# EAGLE design hackgt6-badge-prototype (EAGLE 9.4.2)
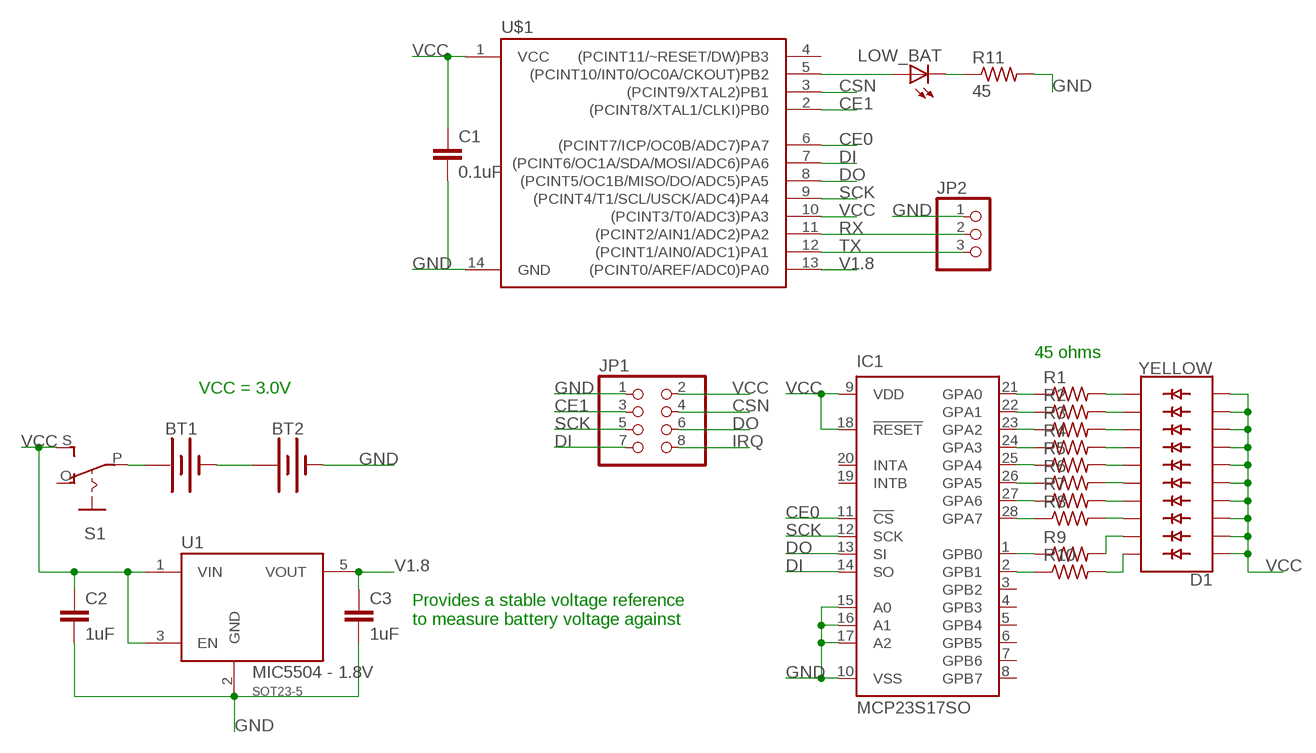
[diagram p0: schematic, sheet 1]

## Parts
BT1  BATTERY-AA-SMD  [BATTERY-AA-SMD]
BT2  BATTERY-AA-SMD  [BATTERY-AA-SMD]
C1  0.1uF  C-EUC1206  [C1206]
C2  1uF  C-EUC1206  [C1206]
C3  1uF  C-EUC1206  [C1206]
D1  YELLOW  LED_BARGRAPH_10YELLOW  [LED_BARGRAPH_10]
IC1  MCP23S17SO  [SO28W]
JP1  PINHD-2X4/90  [2X04/90]
JP2  PINHD-1X3  [1X03]
LOW_BAT  LEDCHIPLED_1206  [CHIPLED_1206]
R1  R-US_R1206  [R1206]
R2  R-US_R1206  [R1206]
R3  R-US_R1206  [R1206]
R4  R-US_R1206  [R1206]
R5  R-US_R1206  [R1206]
R6  R-US_R1206  [R1206]
R7  R-US_R1206  [R1206]
R8  R-US_R1206  [R1206]
R9  R-US_R1206  [R1206]
R10  R-US_R1206  [R1206]
R11  45  R-US_R1206  [R1206]
S1  EG1218S  [EG1218]
U1  MIC5504 - 1.8V  MIC550X-YM5  [SOT23-5-DBV]
U$1  ATTINY84ATTINY84-20PU  [DIP14]

## Nets
CE0: IC1.11(!CS) U$1.6((PCINT7/ICP/OC0B/ADC7)PA7)
CE1: JP1.3 U$1.2((PCINT8/XTAL1/CLKI)PB0)
CSN: JP1.4 U$1.3((PCINT9/XTAL2)PB1)
DI: IC1.14(SO) JP1.7 U$1.7((PCINT6/OC1A/SDA/MOSI/ADC6)PA6)
DO: IC1.13(SI) JP1.6 U$1.8((PCINT5/OC1B/MISO/DO/ADC5)PA5)
GND: BT2.P$2(-) BT2.P$4(-) C1.2 C2.2 C3.2 IC1.10(VSS) IC1.15(A0) IC1.16(A1) IC1.17(A2) JP1.1 JP2.1 R11.2 U1.2(GND) U$1.14(GND)
IRQ: JP1.8
N$1: BT1.P$2(-) BT1.P$4(-) BT2.P$1(+) BT2.P$3(+)
N$2: BT1.P$1(+) BT1.P$3(+) S1.P
N$3: IC1.21(GPA0) R1.1
N$4: LOW_BAT.A U$1.5((PCINT10/INT0/OC0A/CKOUT)PB2)
N$5: IC1.22(GPA1) R2.1
N$6: D1.11(C9) R1.2
N$7: D1.12(C8) R2.2
N$8: D1.13(C7) R3.2
N$9: D1.14(C6) R4.2
N$10: D1.15(C5) R5.2
N$11: D1.16(C4) R6.2
N$12: D1.17(C3) R7.2
N$13: D1.18(C2) R8.2
N$14: D1.19(C1) R9.2
N$15: D1.20(C) R10.2
N$16: IC1.1(GPB0) R9.1
N$17: IC1.2(GPB1) R10.1
N$18: IC1.28(GPA7) R8.1
N$19: IC1.27(GPA6) R7.1
N$20: IC1.26(GPA5) R6.1
N$21: IC1.25(GPA4) R5.1
N$22: IC1.24(GPA3) R4.1
N$23: IC1.23(GPA2) R3.1
N$24: LOW_BAT.C R11.1
RX: JP2.2 U$1.11((PCINT2/AIN1/ADC2)PA2)
SCK: IC1.12(SCK) JP1.5 U$1.9((PCINT4/T1/SCL/USCK/ADC4)PA4)
TX: JP2.3 U$1.12((PCINT1/AIN0/ADC1)PA1)
V1.8: C3.1 U1.5(VOUT) U$1.13((PCINT0/AREF/ADC0)PA0)
VCC: C1.1 C2.1 D1.1(A) D1.2(A1) D1.3(A2) D1.4(A3) D1.5(A4) D1.6(A5) D1.7(A6) D1.8(A7) D1.9(A8) D1.10(A9) IC1.9(VDD) IC1.18(!RESET) JP1.2 S1.S U1.1(VIN) U1.3(EN) U$1.1(VCC) U$1.10((PCINT3/T0/ADC3)PA3)
Unconnected: IC1.3(GPB2) IC1.4(GPB3) IC1.5(GPB4) IC1.6(GPB5) IC1.7(GPB6) IC1.8(GPB7) IC1.19(INTB) IC1.20(INTA) S1.O U$1.4((PCINT11/~RESET/DW)PB3)

## Notes on the sheet
- 45 ohms
- VCC = 3.0V
- Provides a stable voltage reference
  to measure battery voltage against

## Library data of the parts
BT1 BT2 = Batteries:BATTERY: Battery - Single Cell A variety of battery chemistries, sizes, and footprints. Device List: 20MM_PTH - Coin Cell Battery Holder - 20mm (PTH) <https://www.sparkfun.com/products/783> 6.8MM_PTH - Coin Cell Battery Holder - 6.8MM(SMD) <https://www.digikey.com/product-detail/en/seiko-instruments/MS621FE-FL11E/728-1057-ND/1889208?WT.srch=1&gclid=CNOQ5a6LzdQCFZS2wAodXCkE0g> 12MM_SMD - Coin Cell Battery Holder - 12mm (SMD) <https://www.sparkfun.com/products/10592> 12MM_PTH - Coin Cell Battery Holder - 12mm (PTH) <https://www.sparkfun.com/products/7948> 20MM_SMD - 20mm Coin Cell Battery Holder (SMD) (2 legs) Used on the Big Time Watch Kit <https://www.sparkfun.com/products/11734> 20MM_SMD_4LEGS - Coin Cell Battery Holder - 20mm (SMD) <https://www.sparkfun.com/products/11892> 20MM_SMD_4LEGS_OVERPASTE - Coin Cell Battery Holder - 20mm (SMD) <https://www.sparkfun.com/products/11892> (Over-paste on the legs) 24.5MM_PTH - Coin Cell Battery Holder - 24.5mm (PTH) <https://www.sparkfun.com/products/8863> 9V - 9V Battery Holder - PC Mount Used on the SparkFun SparkPunk Sound Kit <https://www.sparkfun.com/products/11177> and SparkFun SparkPunk Sequencer Kit <https://www.sparkfun.com/products/12707> 18650 - Battery Holder - 18650 (PTH) <https://www.sparkfun.com/products/13113> AA - Battery Holder - 1xAA (PTH) <https://www.sparkfun.com/products/7949> AAA - Battery Holder - 1xAAA (PTH) <https://www.sparkfun.com/products/12718> AA_KIT - Battery Holder - 1xAA (PTH) <https://www.sparkfun.com/products/7949> Special kit package - pads only have exposed copper on one side of the board. AAA_KIT - Battery Holder - 1xAAA (PTH) <https://www.sparkfun.com/products/12718> Special kit package - pads only have exposed copper on one side of the board.
C1-C3 = rcl:C-EU: CAPACITOR, European symbol; SPICEPREFIX: C
D1 = SparkFun-LED:LED_BARGRAPH_10: Young Sun LED Tech - YSLB-10251G5-10 10-Segment LED Bar Graph Features: Red Vf = 2.1V, Ifmax = 20mA Yellow Vf = 2.1V, Ifmax = 20mA Blue Vf = 3.4V, Ifmax = 20mA Green Vf = 3.4V, Ifmax = 20mA SparkFun Products: Red <https://www.sparkfun.com/products/9935> Yellow <https://www.sparkfun.com/products/9936> Green <https://www.sparkfun.com/products/9938> Blue <https://www.sparkfun.com/products/9937>; PROD_ID: DIO-10614
IC1 = microchip:MCP23S17: http://ww1.microchip.com/downloads/en/DeviceDoc/21952a.pdf Source: http://ww1.microchip.com/downloads/en/DeviceDoc/21952a.pdf; MF: MICROCHIP; MPN: MCP23S17-E/SO; OC_FARNELL: unknown; OC_NEWARK: 31K2950
JP1 = pinhead:PINHD-2X4: PIN HEADER
JP2 = adafruit:PINHD-1X3: PIN HEADER
LOW_BAT = adafruit:LED: LED OSRAM: - CHIPLED LG R971, LG N971, LY N971, LG Q971, LY Q971, LO R971, LY R971 LH N974, LH R974 LS Q976, LO Q976, LY Q976 LO Q996 - Hyper CHIPLED LW Q18S LB Q993, LB Q99A, LB R99A - SideLED LS A670, LO A670, LY A670, LG A670, LP A670 LB A673, LV A673, LT A673, LW A673 LH A674 LY A675 LS A676, LA A676, LO A676, LY A676, LW A676 LS A679, LY A679, LG A679 - Hyper Micro SIDELED® LS Y876, LA Y876, LO Y876, LY Y876 LT Y87S - SmartLED LW L88C, LW L88S LB L89C, LB L89S, LG L890 LS L89K, LO L89K, LY L89K LS L896, LA L896, LO L896, LY L896 - TOPLED LS T670, LO T670, LY T670, LG T670, LP T670 LSG T670, LSP T670, LSY T670, LOP T670, LYG T670 LG T671, LOG T671, LSG T671 LB T673, LV T673, LT T673, LW T673 LH T674 LS T676, LA T676, LO T676, LY T676, LB T676, LH T676, LSB T676, LW T676 LB T67C, LV T67C, LT T67C, LS T67K, LO T67K, LY T67K, LW E67C LS E67B, LA E67B, LO E67B, LY E67B, LB E67C, LV E67C, LT E67C LW T67C LS T679, LY T679, LG T679 LS T770, LO T770, LY T770, LG T770, LP T770 LB T773, LV T773, LT T773, LW T773 LH T774 LS E675, LA E675, LY E675, LS T675 LS T776, LA T776, LO T776, LY T776, LB T776 LHGB T686 LT T68C, LB T68C - Hyper Mini TOPLED® LB M676 - Mini TOPLED Santana® LG M470 LS M47K, LO M47K, LY M47K Source: http://www.osram.convergy.de/
R1-R11 = rcl:R-US_: RESISTOR, American symbol; SPICEPREFIX: R
S1 = adafruit:EG1218: SLIDING SWITCH 0.1" spacing through hole, vertical SPDT slide switch http://www.ladyada.net/library/pcb/eaglelibrary.html
U1 = borkedlabs-powerics:MIC550X; PACKAGE: SOT23-5
U$1 = SparkFun-IC-Microcontroller:ATTINY84: Atmel 14-pin 2/4/8kB flash uC Datasheet <https://cdn.sparkfun.com/datasheets/Widgets/doc8006.pdf> SparkFun Products Tiny AVR Programmer <https://www.sparkfun.com/products/11801> (PGM-11801) SparkFun Servo Trigger - Continuous Rotation <https://www.sparkfun.com/products/13872> (WIG-13872) SparkFun Servo Trigger <https://www.sparkfun.com/products/13118> (WIG-13118)

## Board
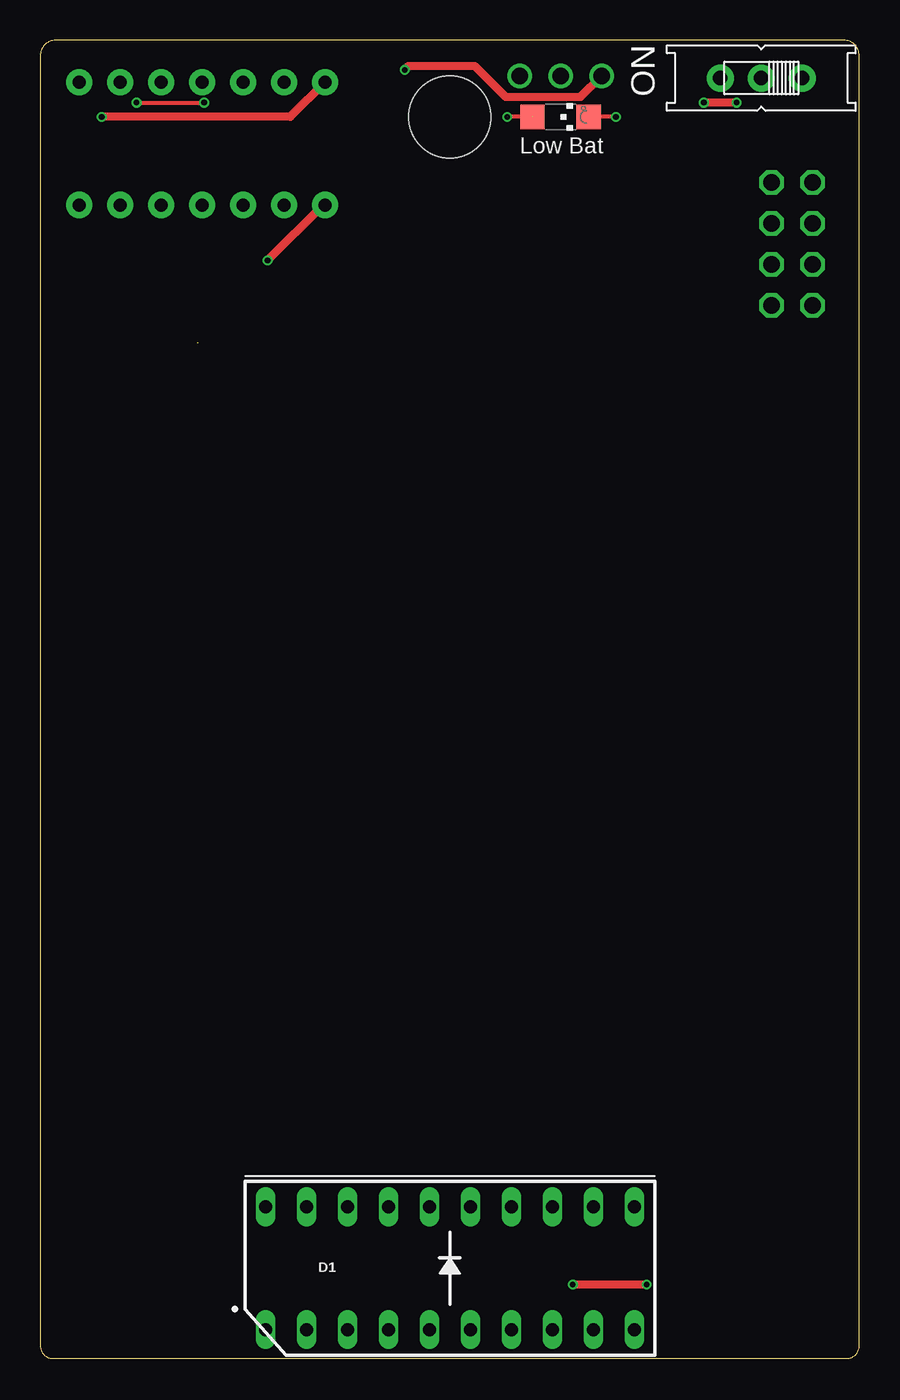
[diagram p1: board, top side]
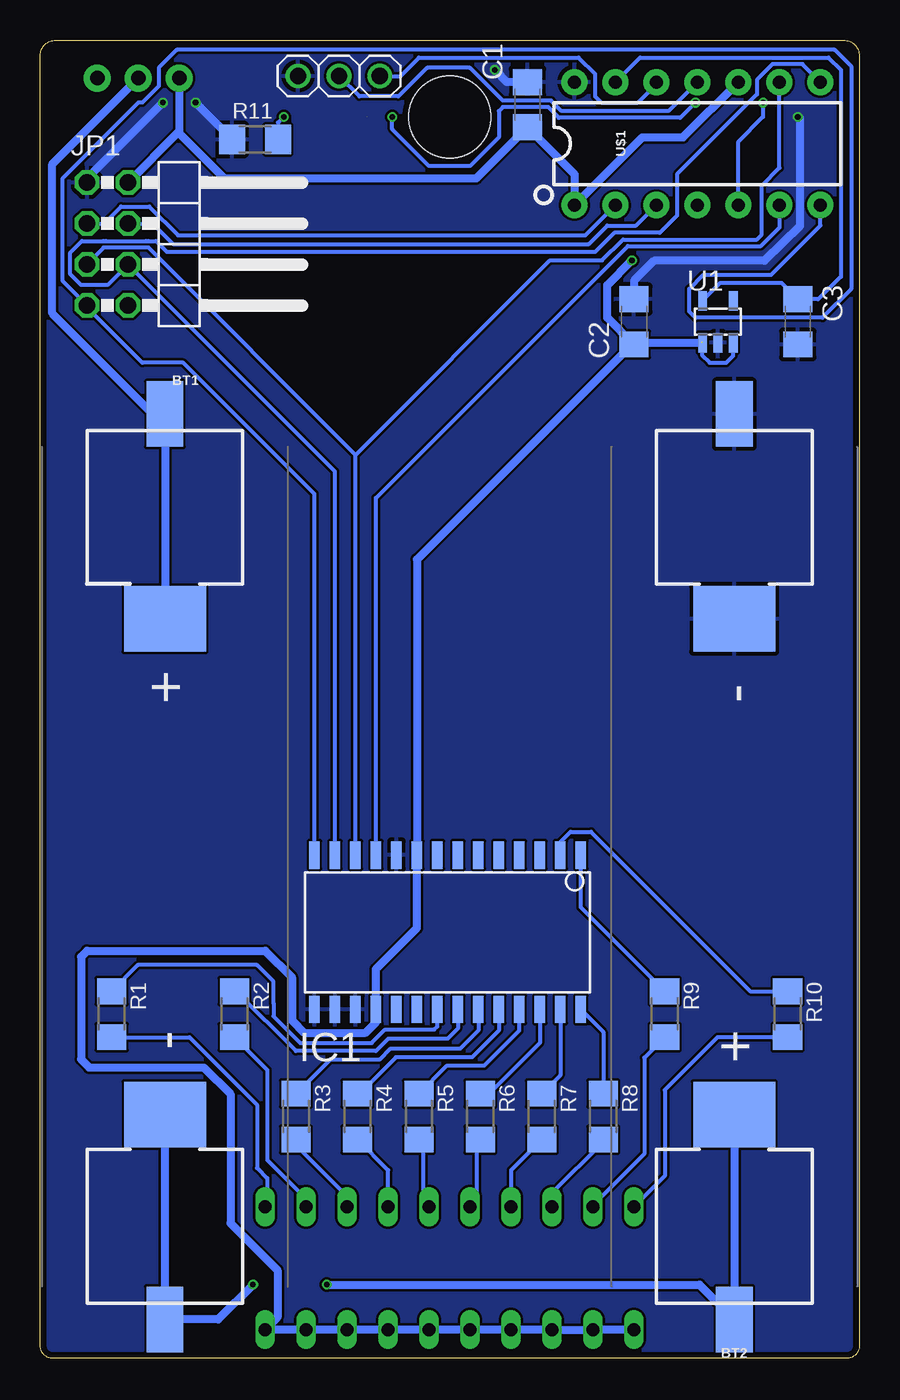
[diagram p2: board, bottom side, seen from below]

Size 50.78 x 81.71 mm. Coordinates in mm from the lower left corner, seen from the top.
Outline: 49.84,81.71 0.94,81.71 arc90 0,80.77 0,0.76 arc90 0.76,0 50.02,0 arc90 50.78,0.76 50.78,80.77 arc90 49.84,81.71
Copper layers (1*16): Top 0.035559375mm / dielectric 1.6mm / Bottom 0.035559375mm
Design rules "oshpark-2layer": minimum track width 6mil, minimum drill 10mil, track to track 6mil, track to pad 6mil, pad to pad 6mil, via to via 6mil, smd to smd 6mil, copper to edge 15mil, drill to drill 6mil, minimum pad ring 5mil, minimum via ring 5mil, stop-mask expansion 2.5mil, vias tented up to drill 0mil, thermal gap 10mil
Holes 5.08 mm at 25.4,76.96

### Footprints (pad centres in the part's own frame; a part is rotated, then mirrored left to right if it is on the bottom)
BATTERY-AA-SMD = smd 4.064 x 2.286: P$1 -28.067,0; P$2 28.067,0 | smd 4.064 x 5.08: P$3 -15.367,0; P$4 15.367,0
C1206 = smd 1.6 x 1.8: 1 -1.4,0; 2 1.4,0
LED_BARGRAPH_10 = drill 0.813 long: 1 -11.43,-3.81; 2 -8.89,-3.81; 3 -6.35,-3.81; 4 -3.81,-3.81; 5 -1.27,-3.81; 6 1.27,-3.81; 7 3.81,-3.81; 8 6.35,-3.81; 9 8.89,-3.81; 10 11.43,-3.81; 11 11.43,3.81; 12 8.89,3.81; 13 6.35,3.81; 14 3.81,3.81; 15 1.27,3.81; 16 -1.27,3.81; 17 -3.81,3.81; 18 -6.35,3.81; 19 -8.89,3.81; 20 -11.43,3.81
SO28W = smd 0.65 x 1.7: 1 -7.62,-4.78; 2 -6.35,-4.78; 3 -5.08,-4.78; 4 -3.81,-4.78; 5 -2.54,-4.78; 6 -1.27,-4.78; 7 0,-4.78; 8 1.27,-4.78; 9 2.54,-4.78; 10 3.81,-4.78; 11 5.08,-4.78; 12 6.35,-4.78; 13 7.62,-4.78; 14 8.89,-4.78; 15 8.89,4.78; 16 7.62,4.78; 17 6.35,4.78; 18 5.08,4.78; 19 3.81,4.78; 20 2.54,4.78; 21 1.27,4.78; 22 0,4.78; 23 -1.27,4.78; 24 -2.54,4.78; 25 -3.81,4.78; 26 -5.08,4.78; 27 -6.35,4.78; 28 -7.62,4.78
2X04/90 = drill 1.016 octagon: 1 -3.81,-6.35; 2 -3.81,-3.81; 3 -1.27,-6.35; 4 -1.27,-3.81; 5 1.27,-6.35; 6 1.27,-3.81; 7 3.81,-6.35; 8 3.81,-3.81
1X03 = drill 1.016: 1 -2.54,0; 2 0,0; 3 2.54,0
CHIPLED_1206 = smd 1.5 x 1.5: A 0,-1.75; C 0,1.75
R1206 = smd 1.6 x 1.803: 1 -1.422,0; 2 1.422,0
EG1218 = drill 0.9 pad 1.676: O -2.54,0; P 0,0; S 2.54,0
SOT23-5-DBV = smd 0.55 x 1.2: 1 -0.95,-1.3; 2 0,-1.3; 3 0.95,-1.3; 4 0.95,1.3; 5 -0.95,1.3
DIP14 = drill 0.813 pad 1.626: 1 -7.62,-3.81; 2 -5.08,-3.81; 3 -2.54,-3.81; 4 0,-3.81; 5 2.54,-3.81; 6 5.08,-3.81; 7 7.62,-3.81; 8 7.62,3.81; 9 5.08,3.81; 10 2.54,3.81; 11 0,3.81; 12 -2.54,3.81; 13 -5.08,3.81; 14 -7.62,3.81

### Placement (x,y rotation side)
BT1  43.05,30.48 270 bottom
BT2  7.75,30.48 90 bottom
C1  20.57,77.72 90 bottom
C2  13.97,64.26 90 bottom
C3  3.81,64.26 270 bottom
D1  25.4,5.59 0 top
IC1  24.89,26.42 180 bottom
JP1  41.53,69.09 270 bottom
JP2  32.26,79.5 0 bottom
LOW_BAT  32.26,76.96 270 top
R1  46.35,21.34 270 bottom
R2  38.73,21.34 270 bottom
R3  34.92,14.99 270 bottom
R4  31.11,14.99 270 bottom
R5  27.3,14.99 270 bottom
R6  23.5,14.99 270 bottom
R7  19.68,14.99 270 bottom
R8  15.88,14.99 270 bottom
R9  12.06,21.34 270 bottom
R10  4.45,21.34 270 bottom
R11  37.47,75.57 180 bottom
S1  44.7,79.38 180 top
U1  8.76,64.26 0 bottom
U$1  10.03,75.31 0 bottom

### Tracks (layer width: path | path; a pad name or v marks a point on that pad's centre or on a via)
CE0
  Bottom 0.254: IC1.11 29.97,53.34 14.35,68.96 6.1,68.96 4.95,70.1 U$1.6
CE1
  Bottom 0.254: U$1.2 16.99,69.62 42.24,69.62 44.02,71.4 45.77,71.4 46.81,70.36 JP1.3
CSN
  Bottom 0.254: JP1.4 43.81,70.36 42.55,69.09 16.76,69.09 15.62,70.23 13.84,70.23 U$1.3
DI
  Bottom 0.254: IC1.14 33.78,53.59 41.91,61.72 44.45,61.72 47.88,65.15 JP1.7 49.38,66.78 49.38,73.18 44.7,77.85 44.45,77.85 43.43,78.87 43.43,80.01 42.32,81.13 1.52,81.13 0.51,80.11 0.51,66.29 2.29,64.52 10.16,64.52 10.54,64.9 10.54,66.29 9.65,67.18 5.46,67.18 2.41,70.23 U$1.7
DO
  Bottom 0.254: IC1.13 32.51,54.99 JP1.6 46.61,66.55 48.26,66.55 48.92,67.21 48.92,68.56 48.21,69.27 46.87,69.27 46.7,69.27 44.24,69.27 | U$1.8 3.53,80.24 5.38,80.24 6.35,79.27 6.35,78.36 11.3,73.41 11.3,70.85 12.38,69.77 15.2,69.77 16.39,68.58 42.93,68.58 43.61,69.27 44.07,69.27 44.24,69.27 | 44.24,69.27
GND  (via drill 0.35)
  Top 0.508: v43.18,77.85 v41.15,77.85 | v22.61,79.88 22.61,79.93 22.82,80.14 26.92,80.14 28.85,78.21 33.5,78.21 JP2.1 | U$1.14 15.49,76.96 v3.81,76.96
  Bottom 0.508: JP1.1 47.88,73.15 v43.18,77.85 | v41.15,77.85 38.89,75.59 R11.2 | C1.2 21.84,79.12 v22.6,79.88 v22.61,79.88 | C2.2 13.97,66.8 12.72,68.05 5.88,68.05 3.68,70.19 3.68,76.89 v3.81,76.96
  pour Bottom: 0,0.13 0,82.04 50.8,82.04 50.8,0.13
N$1  (via drill 0.35)
  Top 0.508: v37.59,4.57 v33.02,4.57
  Bottom 0.508: v37.59,4.57 39.75,2.41 BT1.P$2 BT1.P$4 | v33.02,4.57 9.91,4.57 BT2.P$1 BT2.P$3
N$2
  Bottom 0.508: BT1.P$3 BT1.P$1 43.81,58.55 50.04,64.77 50.04,74.04 S1.P
N$3
  Bottom 0.254: IC1.21 26.16,20.57 26.36,20.38 29.4,20.38 30.23,19.56 34.67,19.56 36.32,21.21 36.32,22.03 36.32,22.35 36.32,23.37 37.34,24.38 44.73,24.38 R1.1
N$4  (via drill 0.35)  (2 unrouted)
  Top 0.254: LOW_BAT.A v28.96,76.96 | v5.97,77.85 v10.16,77.85
  Bottom 0.254: v5.97,77.85 5.97,76.96 7.49,75.44 U$1.5 | v10.16,77.85 11.1,76.91 18.62,76.91 19.29,77.57 22.1,77.57 22.35,77.32 22.35,75.7 24.14,73.91 26.66,73.91 28.96,76.21 v28.96,76.96
N$5
  Bottom 0.254: IC1.22 24.89,20.45 25.53,19.81 29.21,19.81 29.97,19.05 34.92,19.05 38.63,22.76 R2.1
N$6
  Bottom 0.254: R1.2 41.53,19.91 37.34,15.72 37.34,11.81 36.7,11.18 36.7,9.53 D1.11
N$7
  Bottom 0.254: D1.12 34.29,9.88 36.7,12.29 36.7,17.88 R2.2
N$8
  Bottom 0.254: D1.13 31.75,10.03 34.92,13.21 R3.2
N$9
  Bottom 0.254: D1.14 29.21,11.66 R4.2
N$10
  Bottom 0.254: R5.2 27.05,13.31 27.05,9.78 D1.15
N$11
  Bottom 0.254: R6.2 23.75,13.31 23.75,9.78 D1.16
N$12
  Bottom 0.254: R7.2 21.59,11.66 D1.17
N$13
  Bottom 0.254: D1.18 19.05,10.26 15.88,13.44 R8.2
N$14
  Bottom 0.254: D1.19 16.51,9.5 13.34,12.67 13.34,18.64 R9.2
N$15
  Bottom 0.254: R10.2 8.79,19.91 12.06,16.64 12.06,11.3 D1.20
N$16
  Bottom 0.254: R9.1 17.27,27.96 IC1.1
N$17
  Bottom 0.254: IC1.2 18.54,32 17.91,32.64 16.64,32.64 6.76,22.76 R10.1
N$18
  Bottom 0.254: IC1.28 15.88,20.24 R8.1
N$19
  Bottom 0.254: IC1.27 18.54,17.55 R7.1
N$20
  Bottom 0.254: IC1.26 19.81,19.56 22.96,16.41 R6.1
N$21
  Bottom 0.254: R5.1 25.55,18.16 23.24,18.16 21.08,20.32 IC1.25
N$22
  Bottom 0.254: IC1.24 22.35,20.32 24,18.67 28.73,18.67 30.99,16.41 R4.1
N$23
  Bottom 0.254: IC1.23 23.62,20.32 24.74,19.2 29.06,19.2 29.72,18.54 32.79,18.54 R3.1
N$24  (via drill 0.35)
  Top 0.254: v35.69,76.96 LOW_BAT.C
  Bottom 0.254: v35.69,76.96 36.04,76.61 R11.1
RX
  Bottom 0.254: U$1.11 11.84,77.32 18.46,77.32 19.12,77.98 22.11,77.98 24.14,80.01 26.8,80.01 28.57,78.23 30.99,78.23 JP2.2
SCK
  Bottom 0.254: IC1.12 31.24,56.01 | 31.24,56.01 44.07,68.86 46.86,68.86 JP1.5 | 31.24,56.01 19.18,68.07 15.94,68.07 14.65,69.37 6.35,69.37 6.04,69.67 6.04,72.72 4.95,73.81 U$1.9
TX
  Bottom 0.254: JP2.3 28.45,79.5 27.3,80.65 17.4,80.65 16.38,79.63 16.38,78.23 16,77.85 13.72,77.85 12.57,78.99 U$1.12
V1.8
  Bottom 0.254: U$1.13 13.59,80.65 1.91,80.65 1.14,79.88 1.14,67.06 2.54,65.66 C3.1 4.82,66.67 8.6,66.67 U1.5
VCC  (via drill 0.35)  (1 unrouted)
  Top 0.508: v14.1,68.07 17.53,71.5 U$1.1
  Bottom 0.254: C2.1 13.87,62.96 | 9.78,62.87 9.78,62.96 | U1.3 7.81,62.16 8.26,61.72 9.27,61.72 9.71,62.16 U1.1
  Bottom 0.508: D1.1 D1.2 D1.3 D1.4 D1.5 D1.6 D1.7 D1.8 D1.9 D1.10 36.07,2.54 36.07,5.46 38.99,8.38 38.99,16.38 40.64,18.03 47.75,18.03 48.26,18.54 48.26,24.89 47.88,25.27 36.83,25.27 35.18,23.62 35.18,20.95 34.42,20.19 30.61,20.19 29.97,20.83 IC1.18 29.97,24.13 27.43,26.67 IC1.9 27.43,49.53 14.1,62.86 C2.1 15.62,64.51 15.62,66.55 v14.1,68.07 | JP1.2 42.23,76.01 | 42.23,76.01 42.16,76.07 S1.S | 42.23,76.01 39.37,73.15 23.75,73.15 C1.1 17.65,73.4 U$1.1 13.46,75.69 10.92,75.69 U$1.10 | 13.87,62.96 U1.1

### Text on the board
tNames: ON | Low Bat